# Altium schematic sheet 31.SchDoc
size 594 x 420 mm; Scale: 1:1; Разраб.: Соколов; Обозначение документа: ГУИР.203719.145 Э3; Пров.: Станкевич; Номер листа: 25; Общее количество листов: 4; Литера: у; Наименование организации: БГУИР, гр. 750701; Наименование изделия 1: Контроллер ЖКИ; Наименование изделия 2: Схема электрическая; Наименование изделия 3: принципиальная; Нач. отд.: Нач. отд.
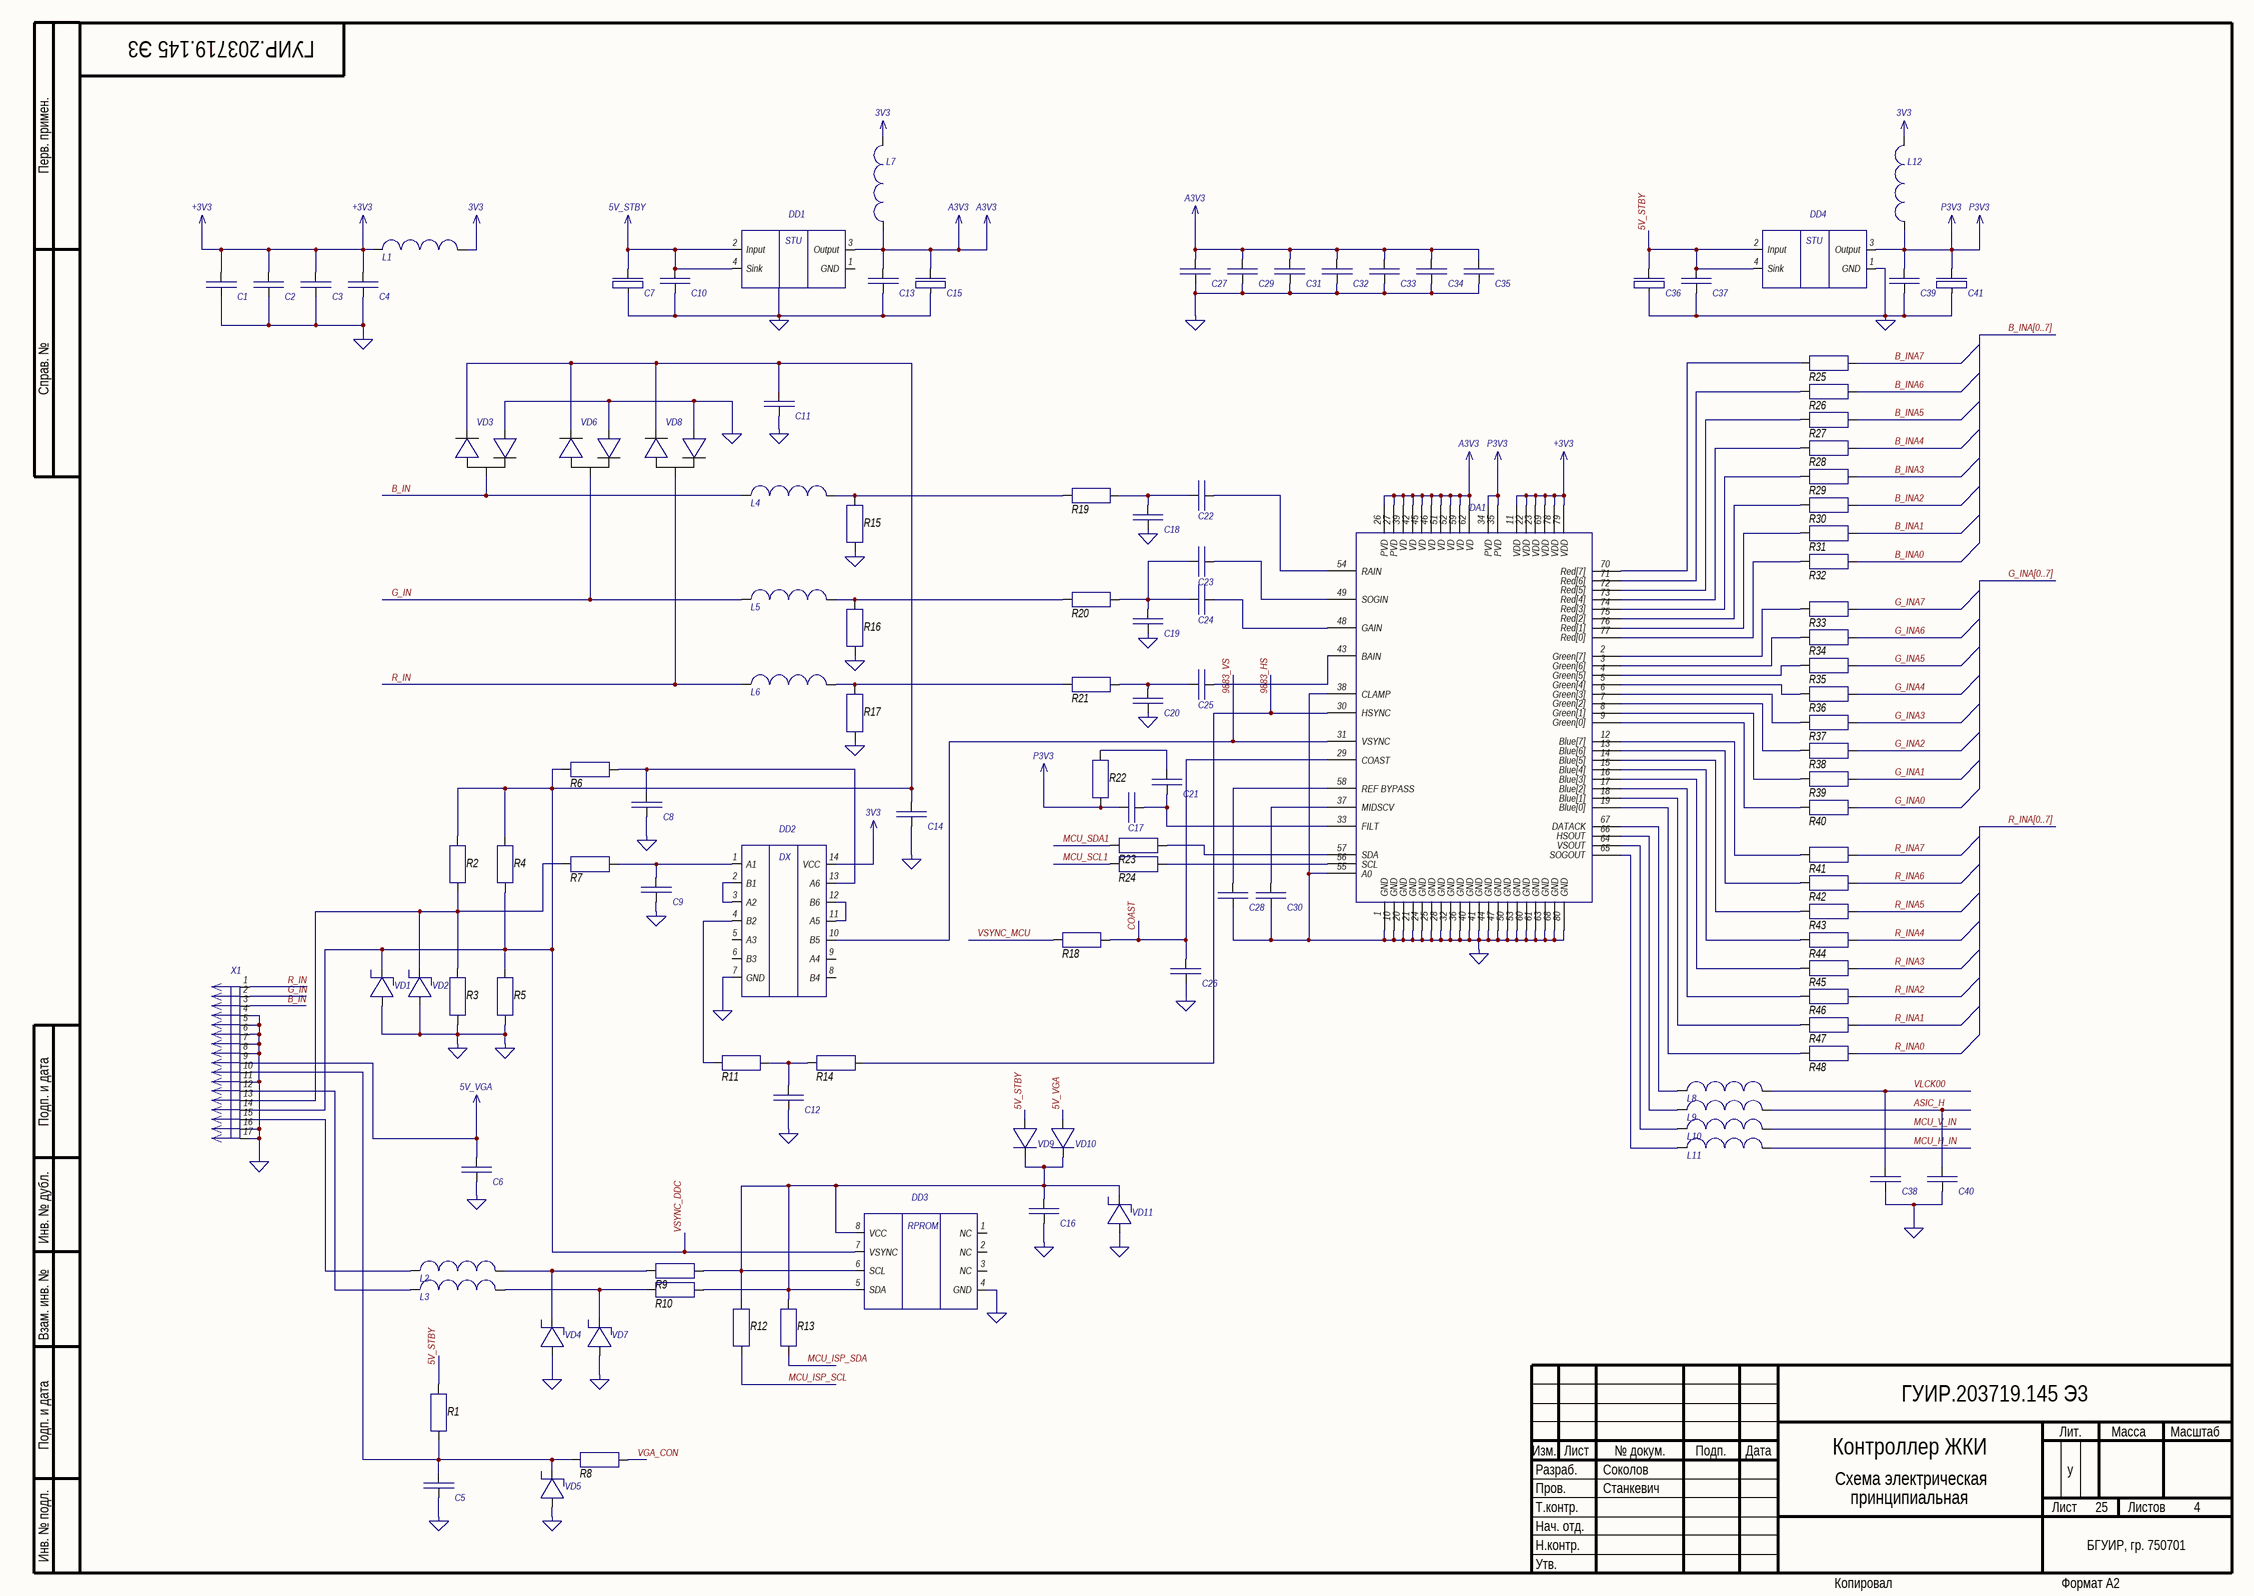
[diagram p0: 31.SchDoc]

## Parts
C1  Capacitor  [cap_electro_13]  (value not drawn)
C2  Capacitor  [cap_electro_13]  (value not drawn)
C3  Capacitor  [cap_electro_13]  (value not drawn)
C4  Capacitor  [cap_electro_13]  (value not drawn)
C5  Capacitor  [cap_electro_13]  (value not drawn)
C6  Capacitor  [cap_electro_13]  (value not drawn)
C7  TuningCapacitor  [Cap_tantal_D]  (value not drawn)
C8  Capacitor  [cap_electro_13]  (value not drawn)
C9  Capacitor  [cap_electro_13]  (value not drawn)
C10  Capacitor  [cap_electro_13]  (value not drawn)
C11  Capacitor  [cap_electro_13]  (value not drawn)
C12  Capacitor  [cap_electro_13]  (value not drawn)
C13  Capacitor  [cap_electro_13]  (value not drawn)
C14  Capacitor  [cap_electro_13]  (value not drawn)
C15  TuningCapacitor  [Cap_tantal_D]  (value not drawn)
C16  Capacitor  [cap_electro_13]  (value not drawn)
C17  Capacitor  [cap_electro_13]  (value not drawn)
C18  Capacitor  [cap_electro_13]  (value not drawn)
C19  Capacitor  [cap_electro_13]  (value not drawn)
C20  Capacitor  [cap_electro_13]  (value not drawn)
C21  Capacitor  [cap_electro_13]  (value not drawn)
C22  Capacitor  [cap_electro_13]  (value not drawn)
C23  Capacitor  [cap_electro_13]  (value not drawn)
C24  Capacitor  [cap_electro_13]  (value not drawn)
C25  Capacitor  [cap_electro_13]  (value not drawn)
C26  Capacitor  [cap_electro_13]  (value not drawn)
C27  Capacitor  [cap_electro_13]  (value not drawn)
C28  Capacitor  [cap_electro_13]  (value not drawn)
C29  Capacitor  [cap_electro_13]  (value not drawn)
C30  Capacitor  [cap_electro_13]  (value not drawn)
C31  Capacitor  [cap_electro_13]  (value not drawn)
C32  Capacitor  [cap_electro_13]  (value not drawn)
C33  Capacitor  [cap_electro_13]  (value not drawn)
C34  Capacitor  [cap_electro_13]  (value not drawn)
C35  Capacitor  [cap_electro_13]  (value not drawn)
C36  TuningCapacitor  [Cap_tantal_D]  (value not drawn)
C37  Capacitor  [cap_electro_13]  (value not drawn)
C38  Capacitor  [cap_electro_13]  (value not drawn)
C39  Capacitor  [cap_electro_13]  (value not drawn)
C40  Capacitor  [cap_electro_13]  (value not drawn)
C41  TuningCapacitor  [Cap_tantal_D]  (value not drawn)
DA1  AD9883ABSTZ-140  [ST_80_2_ADI]  (value not drawn)
DD1  AIC1732  [AIC1732(SOT-89)]  (value not drawn)
DD2  74LVX14  [74LVX14(SO-14)]  (value not drawn)
DD3  24C21  [24Cxx]  (value not drawn)
DD4  AIC1732  [AIC1732(SOT-89)]  (value not drawn)
L1  Inductor  [inductor]  (value not drawn)
L2  Inductor  [inductor]  (value not drawn)
L3  Inductor  [inductor]  (value not drawn)
L4  Inductor  [inductor]  (value not drawn)
L5  Inductor  [inductor]  (value not drawn)
L6  Inductor  [inductor]  (value not drawn)
L7  Inductor  [inductor]  (value not drawn)
L8  Inductor  [inductor]  (value not drawn)
L9  Inductor  [inductor]  (value not drawn)
L10  Inductor  [inductor]  (value not drawn)
L11  Inductor  [inductor]  (value not drawn)
L12  Inductor  [inductor]  (value not drawn)
R1  Resistor  [R_1206]  (value not drawn)
R2  Resistor  [R_1206]  (value not drawn)
R3  Resistor  [R_1206]  (value not drawn)
R4  Resistor  [R_1206]  (value not drawn)
R5  Resistor  [R_1206]  (value not drawn)
R6  Resistor  [R_1206]  (value not drawn)
R7  Resistor  [R_1206]  (value not drawn)
R8  Resistor  [R_1206]  (value not drawn)
R9  Resistor  [R_1206]  (value not drawn)
R10  Resistor  [R_1206]  (value not drawn)
R11  Resistor  [R_1206]  (value not drawn)
R12  Resistor  [R_1206]  (value not drawn)
R13  Resistor  [R_1206]  (value not drawn)
R14  Resistor  [R_1206]  (value not drawn)
R15  Resistor  [R_1206]  (value not drawn)
R16  Resistor  [R_1206]  (value not drawn)
R17  Resistor  [R_1206]  (value not drawn)
R18  Resistor  [R_1206]  (value not drawn)
R19  Resistor  [R_1206]  (value not drawn)
R20  Resistor  [R_1206]  (value not drawn)
R21  Resistor  [R_1206]  (value not drawn)
R22  Resistor  [R_1206]  (value not drawn)
R23  Resistor  [R_1206]  (value not drawn)
R24  Resistor  [R_1206]  (value not drawn)
R25  Resistor  [R_1206]  (value not drawn)
R26  Resistor  [R_1206]  (value not drawn)
R27  Resistor  [R_1206]  (value not drawn)
R28  Resistor  [R_1206]  (value not drawn)
R29  Resistor  [R_1206]  (value not drawn)
R30  Resistor  [R_1206]  (value not drawn)
R31  Resistor  [R_1206]  (value not drawn)
R32  Resistor  [R_1206]  (value not drawn)
R33  Resistor  [R_1206]  (value not drawn)
R34  Resistor  [R_1206]  (value not drawn)
R35  Resistor  [R_1206]  (value not drawn)
R36  Resistor  [R_1206]  (value not drawn)
R37  Resistor  [R_1206]  (value not drawn)
R38  Resistor  [R_1206]  (value not drawn)
R39  Resistor  [R_1206]  (value not drawn)
R40  Resistor  [R_1206]  (value not drawn)
R41  Resistor  [R_1206]  (value not drawn)
R42  Resistor  [R_1206]  (value not drawn)
R43  Resistor  [R_1206]  (value not drawn)
R44  Resistor  [R_1206]  (value not drawn)
R45  Resistor  [R_1206]  (value not drawn)
R46  Resistor  [R_1206]  (value not drawn)
R47  Resistor  [R_1206]  (value not drawn)
R48  Resistor  [R_1206]  (value not drawn)
VD1  DiodeSchottky  [zener_diode]  (value not drawn)
VD2  DiodeSchottky  [zener_diode]  (value not drawn)
VD3  BAV99  [BAV99]  (value not drawn)
VD4  DiodeSchottky  [zener_diode]  (value not drawn)
VD5  DiodeSchottky  [zener_diode]  (value not drawn)
VD6  BAV99  [BAV99]  (value not drawn)
VD7  DiodeSchottky  [zener_diode]  (value not drawn)
VD8  BAV99  [BAV99]  (value not drawn)
VD9  Diode  [zener_diode]  (value not drawn)
VD10  Diode  [zener_diode]  (value not drawn)
VD11  DiodeSchottky  [zener_diode]  (value not drawn)
X1  DB-15  [VGA]  (value not drawn)

## Nets
3V3: DD2.14(VCC) L1.2 L7.2 L12.2
5V_STBY: C7.1 C10.1 C36.1 C37.1 DD1.2(Input) DD1.4(Sink) DD4.2(Input) DD4.4(Sink) R1.2 VD9.1
5V_VGA: C6.2 VD10.1 X1.9
+3V3: C1.1 C2.1 C3.1 C4.1 DA1.11(VDD) DA1.22(VDD) DA1.23(VDD) DA1.69(VDD) DA1.78(VDD) DA1.79(VDD) L1.1
A3V3: C13.1 C15.1 C27.1 C29.1 C31.1 C32.1 C33.1 C34.1 C35.1 DA1.26(PVD) DA1.27(PVD) DA1.39(VD) DA1.42(VD) DA1.45(VD) DA1.46(VD) DA1.51(VD) DA1.52(VD) DA1.59(VD) DA1.62(VD) DD1.3(Output) L7.1
GND: C1.2 C2.2 C3.2 C4.2 C5.2 C6.1 C7.2 C8.2 C9.2 C10.2 C11.2 C12.2 C13.2 C14.2 C15.2 C16.2 C18.2 C19.2 C20.2 C26.1 C27.2 C28.1 C29.2 C30.1 C31.2 C32.2 C33.2 C34.2 C35.2 C36.2 C37.2 C38.2 C39.2 C40.2 C41.2 DA1.1(GND) DA1.10(GND) DA1.20(GND) DA1.21(GND) DA1.24(GND) DA1.25(GND) DA1.28(GND) DA1.32(GND) DA1.36(GND) DA1.38(CLAMP) DA1.40(GND) DA1.41(GND) DA1.44(GND) DA1.47(GND) DA1.50(GND) DA1.53(GND) DA1.55(A0) DA1.60(GND) DA1.61(GND) DA1.63(GND) DA1.68(GND) DA1.80(GND) DD2.7(GND) DD3.4(GND) DD4.1(GND) R3.1 R5.1 R15.1 R16.1 R17.1 VD1.1 VD2.1 VD3.1 VD4.1 VD5.1 VD6.1 VD7.1 VD8.1 VD11.1 X1.4 X1.5 X1.6 X1.7 X1.8 X1.11 X1.16 X1.17
P3V3: C17.2 C39.1 C41.1 DA1.34(PVD) DA1.35(PVD) DD4.3(Output) L12.1 R22.1
9883_HS: DA1.30(HSYNC) R14.2
9883_VS: DA1.31(VSYNC) DD2.10(B5)
ASIC_H: C40.1 L9.2
B_IN: L4.1 VD3.3 X1.3
B_INA0: R32.2
B_INA1: R31.2
B_INA2: R30.2
B_INA3: R29.2
B_INA4: R28.2
B_INA5: R27.2
B_INA6: R26.2
B_INA7: R25.2
COAST: C26.2 DA1.29(COAST) R18.2
G_IN: L5.1 VD6.3 X1.2
G_INA0: R40.2
G_INA1: R39.2
G_INA2: R38.2
G_INA3: R37.2
G_INA4: R36.2
G_INA5: R35.2
G_INA6: R34.2
G_INA7: R33.2
MCU_H_IN: L11.2
MCU_ISP_SCL: R12.1
MCU_ISP_SDA: R13.1
MCU_SCL1: R24.1
MCU_SDA1: R23.1
MCU_V_IN: L10.2
R_IN: L6.1 VD8.3 X1.1
R_INA0: R48.2
R_INA1: R47.2
R_INA2: R46.2
R_INA3: R45.2
R_INA4: R44.2
R_INA5: R43.2
R_INA6: R42.2
R_INA7: R41.2
VGA_CON: R8.2
VLCK00: C38.1 L8.2
VSYNC_DDC: C11.1 C14.1 DD3.7(VSYNC) R2.2 R4.1 R4.2 R5.2 R6.1 VD1.2 VD3.2 VD6.2 VD8.2 X1.14
VSYNC_MCU: R18.1
NetC5_1: C5.1 R1.1 R8.1 VD5.2 X1.10
NetC8_1: C8.1 DD2.13(A6) R6.2
NetC9_1: C9.1 DD2.1(A1) R7.2
NetC12_1: C12.1 R11.2 R14.1
NetC16_1: C16.1 DD3.5(SDA) DD3.6(SCL) DD3.8(VCC) R9.2 R10.2 R12.2 R13.2 VD9.2 VD10.2 VD11.2
NetC17_1: C17.1 C21.1 DA1.33(FILT)
NetC18_1: C18.1 C22.2 R19.2
NetC19_1: C19.1 C23.2 C24.2 R20.2
NetC20_1: C20.1 C25.2 R21.2
NetC21_2: C21.2 R22.2
NetC22_1: C22.1 DA1.54(RAIN)
NetC23_1: C23.1 DA1.49(SOGIN)
NetC24_1: C24.1 DA1.48(GAIN)
NetC25_1: C25.1 DA1.43(BAIN)
NetC28_2: C28.2 DA1.58(REF_BYPASS)
NetC30_2: C30.2 DA1.37(MIDSCV)
NetDA1_2: DA1.2(Green[7]) R33.1
NetDA1_3: DA1.3(Green[6]) R34.1
NetDA1_4: DA1.4(Green[5]) R35.1
NetDA1_5: DA1.5(Green[4]) R36.1
NetDA1_6: DA1.6(Green[3]) R37.1
NetDA1_7: DA1.7(Green[2]) R38.1
NetDA1_8: DA1.8(Green[1]) R39.1
NetDA1_9: DA1.9(Green[0]) R40.1
NetDA1_12: DA1.12(Blue[7]) R41.1
NetDA1_13: DA1.13(Blue[6]) R42.1
NetDA1_14: DA1.14(Blue[5]) R43.1
NetDA1_15: DA1.15(Blue[4]) R44.1
NetDA1_16: DA1.16(Blue[3]) R45.1
NetDA1_17: DA1.17(Blue[2]) R46.1
NetDA1_18: DA1.18(Blue[1]) R47.1
NetDA1_19: DA1.19(Blue[0]) R48.1
NetDA1_56: DA1.56(SCL) R24.2
NetDA1_57: DA1.57(SDA) R23.2
NetDA1_64: DA1.64(VSOUT) L10.1
NetDA1_65: DA1.65(SOGOUT) L11.1
NetDA1_66: DA1.66(HSOUT) L9.1
NetDA1_67: DA1.67(DATACK) L8.1
NetDA1_70: DA1.70(Red[7]) R25.1
NetDA1_71: DA1.71(Red[6]) R26.1
NetDA1_72: DA1.72(Red[5]) R27.1
NetDA1_73: DA1.73(Red[4]) R28.1
NetDA1_74: DA1.74(Red[3]) R29.1
NetDA1_75: DA1.75(Red[2]) R30.1
NetDA1_76: DA1.76(Red[1]) R31.1
NetDA1_77: DA1.77(Red[0]) R32.1
NetDD2_2: DD2.2(B1) DD2.3(A2)
NetDD2_4: DD2.4(B2) R11.1
NetDD2_11: DD2.11(A5) DD2.12(B6)
NetL2_1: L2.1 X1.15
NetL2_2: L2.2 R9.1 VD4.2
NetL3_1: L3.1 X1.12
NetL3_2: L3.2 R10.1 VD7.2
NetL4_2: L4.2 R15.2 R19.1
NetL5_2: L5.2 R16.2 R20.1
NetL6_2: L6.2 R17.2 R21.1
NetR2_1: R2.1 R3.2 R7.1 VD2.2 X1.13

Not connected (* = marked no-connect by the designer): DD1 1(GND); DD2 5(A3) 6(B3) 8(B4) 9(A4); DD3 1(NC) 2(NC) 3(NC)

## Buses and harness runs
bus B_INA[0..7]
bus G_INA[0..7]
bus R_INA[0..7]

## Notes on the sheet
- Перв. примен.
- Справ. №
- Подп. и дата
- Инв. № дубл.
- Взам. инв. №
- Разраб.
- Изм.
- Лист
- № докум.
- Подп.
- Дата
- Лит.
- Масса
- Масштаб
- Пров.
- Т.контр.
- Листов
- Инв. № подл.
- Утв.
- Н.контр.
- Копировал
- Формат А2
- (in symbol 24C21) RPROM
- (in symbol 74LVX14) DX
- (in symbol AIC1732) STU

## Library data of the parts
DA1 = AD9883ABSTZ-140: Built_By: EMA_UL_Team; Vendor: Analog Devices Inc; SourceLibrary: Analog_2012-01-01_6; Manufacturer_Part_Number: AD9883ABSTZ-140; Copyright: Copyright (C) 2018 Accelerated Designs. All rights reserved; RefDes: RefDes; Type: DEV
X1 = VGA_connector